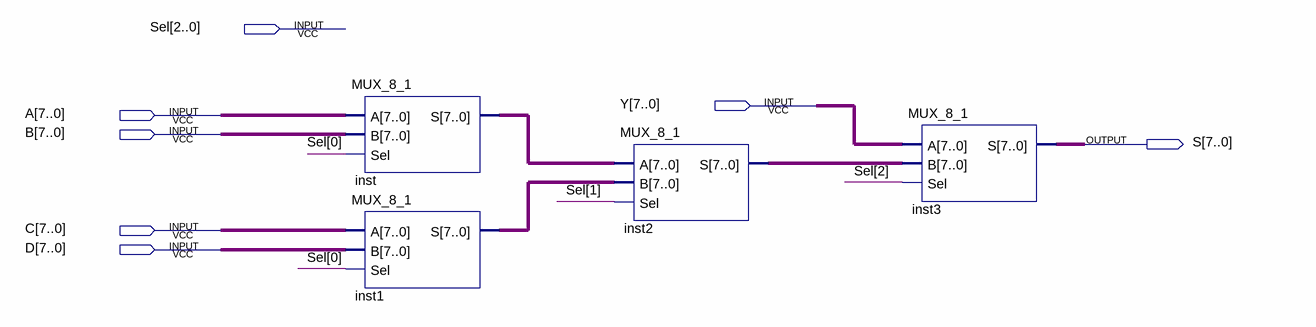
[diagram p0: schematic sheet]
// Quartus schematic MUX_8_3.bdf as structural Verilog: 4 symbols, 7 pins
module MUX_8_3 (
  input  [2:0] Sel,
  input  [7:0] Y,
  input  [7:0] A,
  input  [7:0] B,
  input  [7:0] C,
  input  [7:0] D,
  output [7:0] S
);

  wire [7:0] inst1_s, inst2_s, inst_s;

  MUX_8_1 inst (.A(A), .B(B), .Sel(Sel[0]), .S(inst_s));
  MUX_8_1 inst1 (.A(C), .B(D), .Sel(Sel[0]), .S(inst1_s));
  MUX_8_1 inst2 (.A(inst_s), .B(inst1_s), .Sel(Sel[1]), .S(inst2_s));
  MUX_8_1 inst3 (.A(Y), .B(inst2_s), .Sel(Sel[2]), .S(S));
endmodule
